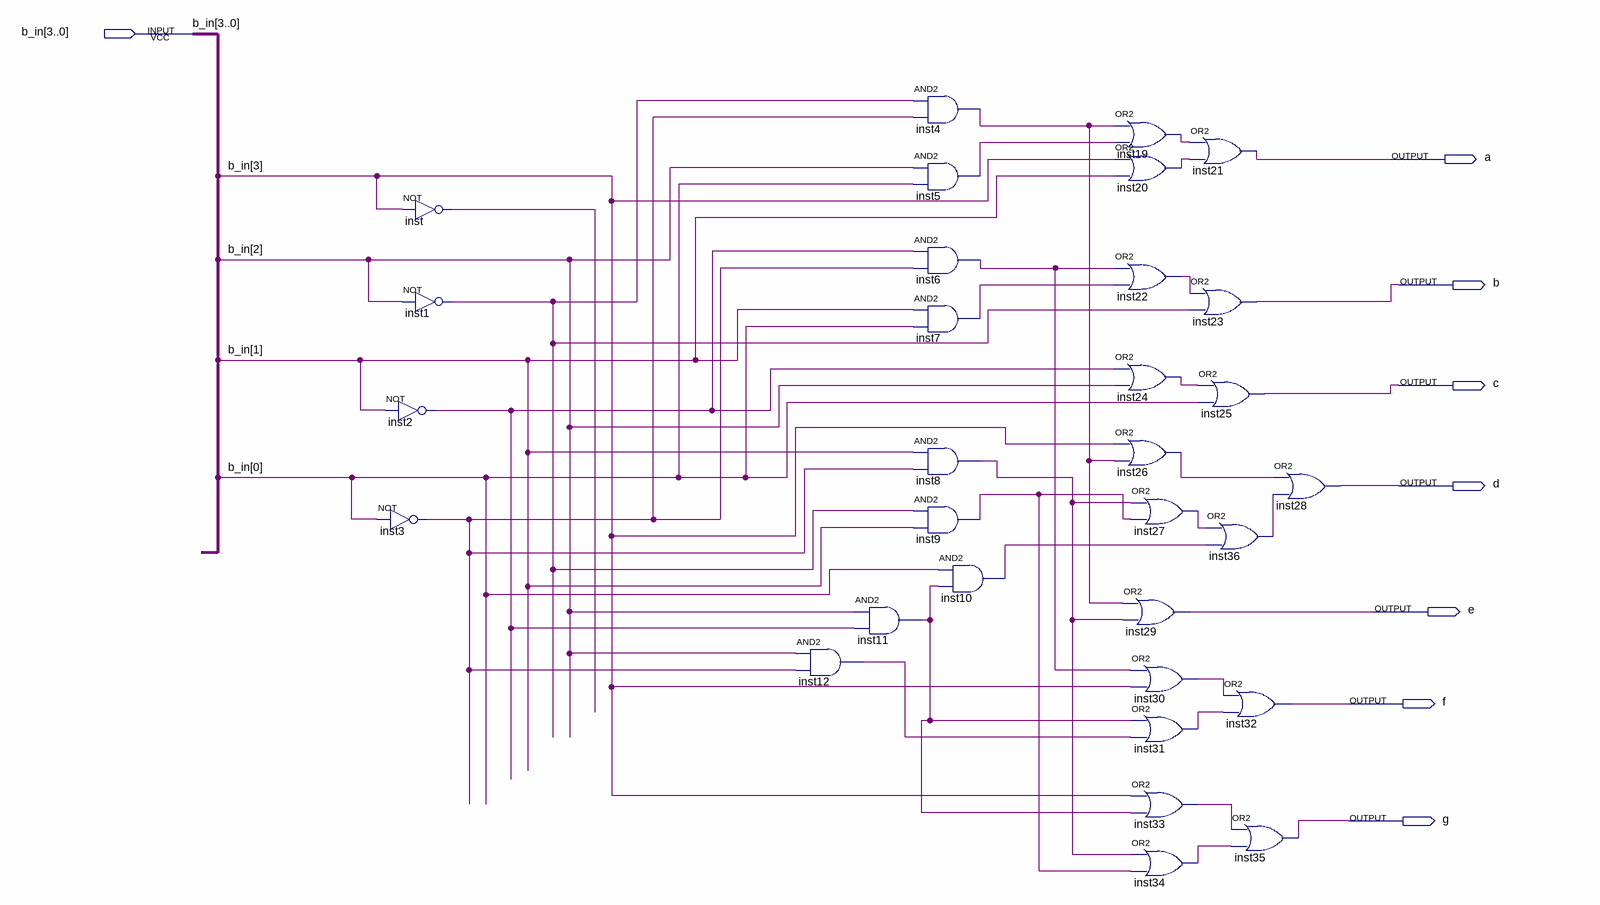
[diagram p0: schematic sheet]
// Quartus schematic b2seg_bus.bdf as structural Verilog: 31 symbols, 8 pins
module b2seg_bus (
  input  [3:0] b_in,
  output a,
  output b,
  output c,
  output d,
  output e,
  output f,
  output g
);

  wire inst1_out, inst2_out, inst3_out, inst4_out, inst5_out, inst6_out, inst7_out, inst8_out, inst9_out,
       inst10_out, inst11_out, inst12_out, inst19_out, inst20_out, inst22_out, inst24_out, inst26_out,
       inst27_out, inst30_out, inst31_out, inst33_out, inst34_out, inst36_out, inst_out;

  not inst (inst_out, b_in[3]);
  not inst1 (inst1_out, b_in[2]);
  not inst2 (inst2_out, b_in[1]);
  not inst3 (inst3_out, b_in[0]);
  and inst12 (inst12_out, b_in[2], inst3_out);
  and inst11 (inst11_out, b_in[2], inst2_out);
  and inst4 (inst4_out, inst1_out, inst3_out);
  and inst5 (inst5_out, b_in[2], b_in[0]);
  and inst6 (inst6_out, inst2_out, inst3_out);
  and inst7 (inst7_out, b_in[1], b_in[0]);
  and inst8 (inst8_out, b_in[1], inst3_out);
  and inst9 (inst9_out, inst1_out, b_in[1]);
  and inst10 (inst10_out, b_in[0], inst11_out);
  or inst19 (inst19_out, inst4_out, inst5_out);
  or inst20 (inst20_out, b_in[3], b_in[1]);
  or inst22 (inst22_out, inst6_out, inst7_out);
  or inst24 (inst24_out, inst2_out, b_in[2]);
  or inst26 (inst26_out, b_in[3], inst4_out);
  or inst27 (inst27_out, inst8_out, inst9_out);
  or inst29 (e, inst4_out, inst8_out);
  or inst30 (inst30_out, inst6_out, b_in[3]);
  or inst31 (inst31_out, inst11_out, inst12_out);
  or inst33 (inst33_out, b_in[3], inst11_out);
  or inst34 (inst34_out, inst8_out, inst9_out);
  or inst21 (a, inst19_out, inst20_out);
  or inst23 (b, inst22_out, inst1_out);
  or inst25 (c, inst24_out, b_in[0]);
  or inst36 (inst36_out, inst27_out, inst10_out);
  or inst32 (f, inst30_out, inst31_out);
  or inst28 (d, inst26_out, inst36_out);
  or inst35 (g, inst33_out, inst34_out);
endmodule
